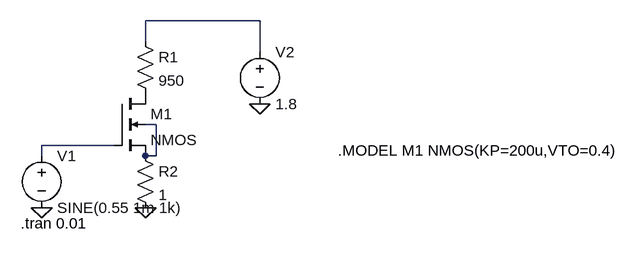
[diagram p0: schematic nmos.asc]
nmos.asc, the LTspice schematic file:
Version 4.1
SHEET 1 924 680
WIRE 352 48 176 48
WIRE 176 80 176 48
WIRE 352 96 352 48
WIRE 192 208 176 208
WIRE 128 240 16 240
WIRE 16 256 16 240
WIRE 192 256 192 208
WIRE 192 256 176 256
FLAG 352 176 0
FLAG 176 336 0
FLAG 16 336 0
SYMBOL res 160 64 R0
SYMATTR InstName R1
SYMATTR Value 950
SYMBOL res 160 240 R0
SYMATTR InstName R2
SYMATTR Value 1
SYMBOL nmos4 128 160 R0
SYMATTR InstName M1
SYMATTR Value2 l=1u w=400u
SYMBOL voltage 16 240 R0
WINDOW 123 0 0 Left 0
WINDOW 39 0 0 Left 0
SYMATTR InstName V1
SYMATTR Value SINE(0.55 1m 1k)
SYMBOL voltage 352 80 R0
WINDOW 123 0 0 Left 0
WINDOW 39 0 0 Left 0
SYMATTR InstName V2
SYMATTR Value 1.8
TEXT -16 360 Left 2 !.tran 0.01
TEXT 472 248 Left 2 !.MODEL M1 NMOS(KP=200u,VTO=0.4)

The netlist it stands for:
* nmos.asc
R1 N001 P001 950
R2 N002 0 1
M1 P001 N003 N002 N002 NMOS l=1u w=400u
V1 N003 0 SINE(0.55 1m 1k)
V2 N001 0 1.8
.model NMOS NMOS
.model PMOS PMOS
.lib standard.mos
.tran 0.01
.MODEL M1 NMOS(KP=200u,VTO=0.4)
.backanno
.end